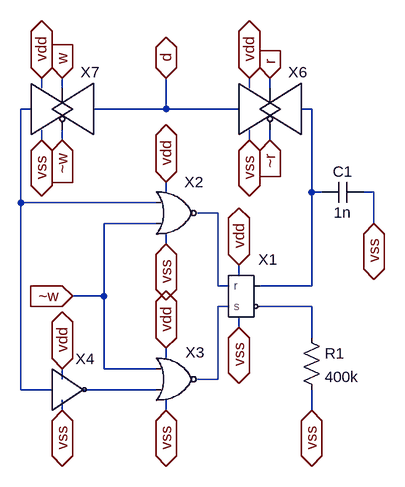
[diagram p0: schematic 1_bit_sram_cell.asc]
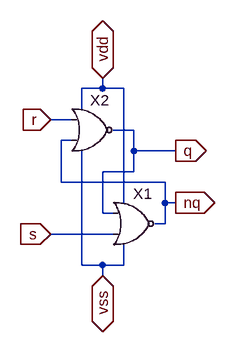
[diagram p1: sub-circuit sr_latch.asc]
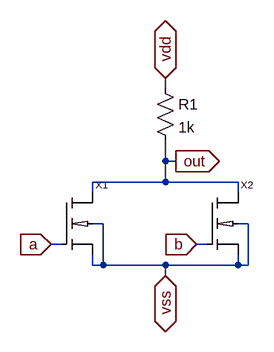
[diagram p2: sub-circuit nor.asc]
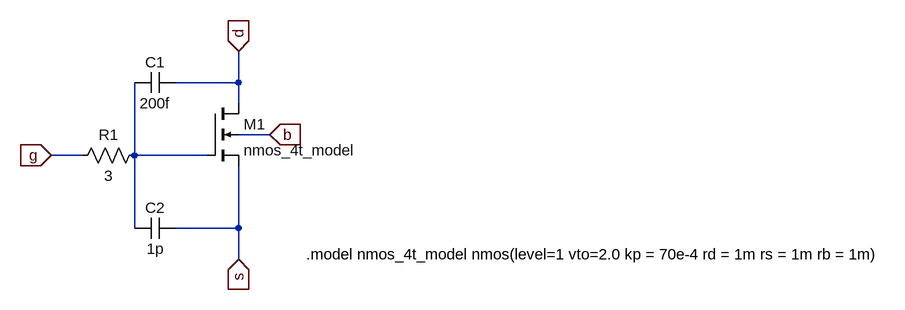
[diagram p3: sub-circuit nmos_4t.asc]
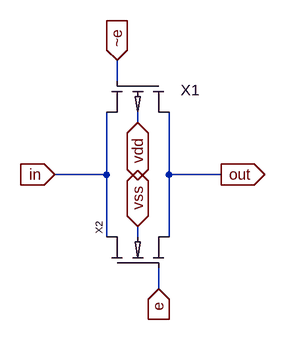
[diagram p4: sub-circuit transmission_gate.asc]
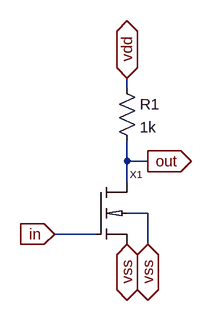
[diagram p5: sub-circuit not.asc]
1_bit_sram_cell.asc, the LTspice schematic file:
Version 4
SHEET 1 880 680
WIRE -128 -96 -128 -112
WIRE -96 -96 -96 -112
WIRE 192 -96 192 -112
WIRE 224 -96 224 -112
WIRE -144 -64 -160 -64
WIRE 64 -64 64 -112
WIRE 64 -64 -48 -64
WIRE 176 -64 64 -64
WIRE 288 -64 272 -64
WIRE -128 -16 -128 -32
WIRE -96 -16 -96 -32
WIRE 192 -16 192 -32
WIRE 224 -16 224 -32
WIRE 64 64 64 48
WIRE 288 64 288 -64
WIRE 304 64 288 64
WIRE 384 64 368 64
WIRE -160 80 -160 -64
WIRE 48 80 -160 80
WIRE 144 96 112 96
WIRE 48 112 -32 112
WIRE 384 112 384 64
WIRE 64 144 64 128
WIRE 176 192 176 176
WIRE 144 208 144 96
WIRE 160 208 144 208
WIRE 288 208 288 64
WIRE 288 208 208 208
WIRE -32 224 -32 112
WIRE -32 224 -80 224
WIRE 160 240 144 240
WIRE 288 240 208 240
WIRE 176 272 176 256
WIRE 288 288 288 240
WIRE 64 320 64 304
WIRE -32 336 -32 224
WIRE 48 336 -32 336
WIRE -96 352 -96 336
WIRE 144 352 144 240
WIRE 144 352 112 352
WIRE -160 368 -160 80
WIRE -112 368 -160 368
WIRE 48 368 -64 368
WIRE -96 400 -96 384
WIRE 64 400 64 384
WIRE 288 400 288 368
FLAG 64 48 vdd
IOPIN 64 48 BiDir
FLAG 64 144 vss
IOPIN 64 144 BiDir
FLAG 64 304 vdd
IOPIN 64 304 BiDir
FLAG 64 400 vss
IOPIN 64 400 BiDir
FLAG -96 -112 w
IOPIN -96 -112 In
FLAG 224 -112 r
IOPIN 224 -112 In
FLAG -80 224 ~w
IOPIN -80 224 In
FLAG 64 -112 d
IOPIN 64 -112 BiDir
FLAG -96 -16 ~w
IOPIN -96 -16 In
FLAG 224 -16 ~r
IOPIN 224 -16 In
FLAG -128 -112 vdd
IOPIN -128 -112 BiDir
FLAG -128 -16 vss
IOPIN -128 -16 BiDir
FLAG 192 -112 vdd
IOPIN 192 -112 BiDir
FLAG 192 -16 vss
IOPIN 192 -16 BiDir
FLAG 176 272 vss
IOPIN 176 272 BiDir
FLAG 176 176 vdd
IOPIN 176 176 BiDir
FLAG 288 400 vss
IOPIN 288 400 BiDir
FLAG -96 400 vss
IOPIN -96 400 BiDir
FLAG -96 336 vdd
IOPIN -96 336 BiDir
FLAG 384 112 vss
IOPIN 384 112 BiDir
SYMBOL sr_latch 192 224 R0
WINDOW 0 29 -41 Bottom 2
SYMATTR InstName X1
SYMBOL nor 80 32 R0
WINDOW 0 12 16 Left 2
SYMATTR InstName X2
SYMBOL nor 80 288 R0
WINDOW 0 14 23 Left 2
SYMATTR InstName X3
SYMBOL transmission_gate -96 -64 R0
WINDOW 0 43 -41 Bottom 2
SYMATTR InstName X7
SYMBOL transmission_gate 224 -64 R0
WINDOW 0 43 -41 Bottom 2
SYMATTR InstName X6
SYMBOL res 272 272 R0
SYMATTR InstName R1
SYMATTR Value 400k
SYMBOL not -112 368 R0
WINDOW 0 51 -32 Bottom 2
SYMATTR InstName X4
SYMBOL cap 368 48 R90
WINDOW 0 0 32 VBottom 2
WINDOW 3 32 32 VTop 2
SYMATTR InstName C1
SYMATTR Value 1n

sr_latch.asc, the sub-circuit schematic file:
Version 4
SHEET 1 880 680
WIRE 208 0 208 -16
WIRE 208 0 176 0
WIRE 240 0 208 0
WIRE 176 32 176 0
WIRE 160 48 128 48
WIRE 256 64 224 64
WIRE 160 80 144 80
WIRE 256 96 256 64
WIRE 320 96 256 96
WIRE 256 128 256 96
WIRE 256 128 208 128
WIRE 144 144 144 80
WIRE 304 144 144 144
WIRE 240 176 240 0
WIRE 304 176 304 144
WIRE 320 176 304 176
WIRE 208 192 208 128
WIRE 224 192 208 192
WIRE 304 208 304 176
WIRE 304 208 288 208
WIRE 224 224 128 224
WIRE 176 272 176 96
WIRE 208 272 176 272
WIRE 240 272 240 240
WIRE 240 272 208 272
WIRE 208 288 208 272
FLAG 128 224 s
IOPIN 128 224 In
FLAG 128 48 r
IOPIN 128 48 In
FLAG 320 96 q
IOPIN 320 96 Out
FLAG 320 176 nq
IOPIN 320 176 Out
FLAG 208 288 vss
IOPIN 208 288 BiDir
FLAG 208 -16 vdd
IOPIN 208 -16 BiDir
SYMBOL nor 256 144 R0
WINDOW 0 -1 18 Left 2
SYMATTR InstName X1
SYMBOL nor 192 0 R0
WINDOW 0 -3 18 Left 2
SYMATTR InstName X2

nor.asc, the sub-circuit schematic file:
Version 4
SHEET 1 880 680
WIRE 240 48 240 32
WIRE 240 160 240 128
WIRE 256 160 240 160
WIRE 240 192 240 160
WIRE 240 192 128 192
WIRE 352 192 240 192
WIRE 128 208 128 192
WIRE 352 208 352 192
WIRE 144 256 128 256
WIRE 368 256 352 256
WIRE 80 288 64 288
WIRE 304 288 288 288
WIRE 128 320 128 304
WIRE 144 320 144 256
WIRE 144 320 128 320
WIRE 240 320 144 320
WIRE 352 320 352 304
WIRE 352 320 240 320
WIRE 368 320 368 256
WIRE 368 320 352 320
WIRE 240 336 240 320
FLAG 240 32 vdd
IOPIN 240 32 BiDir
FLAG 240 336 vss
IOPIN 240 336 BiDir
FLAG 256 160 out
IOPIN 256 160 Out
FLAG 288 288 b
IOPIN 288 288 In
FLAG 64 288 a
IOPIN 64 288 In
SYMBOL res 224 32 R0
SYMATTR InstName R1
SYMATTR Value 1k
SYMBOL nmos_4t 80 208 R0
SYMATTR InstName X1
SYMBOL nmos_4t 304 208 R0
SYMATTR InstName X2

nmos_4t.asc, the sub-circuit schematic file:
Version 4
SHEET 1 880 680
WIRE -288 -224 -288 -272
WIRE -288 -224 -384 -224
WIRE -288 -192 -288 -224
WIRE -240 -144 -288 -144
WIRE -528 -112 -576 -112
WIRE -448 -112 -448 -224
WIRE -336 -112 -448 -112
WIRE -448 0 -448 -112
WIRE -288 0 -288 -96
WIRE -288 0 -384 0
WIRE -288 48 -288 0
FLAG -576 -112 g
IOPIN -576 -112 In
FLAG -288 -272 d
IOPIN -288 -272 In
FLAG -288 48 s
IOPIN -288 48 In
FLAG -240 -144 b
IOPIN -240 -144 In
SYMBOL nmos4 -336 -192 R0
SYMATTR InstName M1
SYMATTR Value nmos_4t_model
SYMBOL cap -384 -240 R90
WINDOW 0 0 32 VBottom 2
WINDOW 3 32 32 VTop 2
SYMATTR InstName C1
SYMATTR Value 200f
SYMBOL cap -384 -16 R90
WINDOW 0 0 32 VBottom 2
WINDOW 3 32 32 VTop 2
SYMATTR InstName C2
SYMATTR Value 1p
SYMBOL res -432 -128 R90
WINDOW 0 0 56 VBottom 2
WINDOW 3 32 56 VTop 2
SYMATTR InstName R1
SYMATTR Value 3
TEXT -184 40 Left 2 !.model nmos_4t_model nmos(level=1 vto=2.0 kp = 70e-4 rd = 1m rs = 1m rb = 1m)

transmission_gate.asc, the sub-circuit schematic file:
Version 4
SHEET 1 880 680
WIRE 208 16 208 -16
WIRE 240 80 240 64
WIRE 192 160 192 64
WIRE 192 160 112 160
WIRE 288 160 288 64
WIRE 368 160 288 160
WIRE 192 256 192 160
WIRE 240 256 240 240
WIRE 288 256 288 160
WIRE 272 336 272 304
FLAG 112 160 in
IOPIN 112 160 In
FLAG 272 336 e
IOPIN 272 336 In
FLAG 368 160 out
IOPIN 368 160 Out
FLAG 208 -16 ~e
IOPIN 208 -16 In
FLAG 240 80 vdd
IOPIN 240 80 BiDir
FLAG 240 240 vss
IOPIN 240 240 BiDir
SYMBOL pmos_4t 288 16 R90
WINDOW 0 14 -47 VRight 2
SYMATTR InstName X1
SYMBOL nmos_4t 192 304 R270
SYMATTR InstName X2

not.asc, the sub-circuit schematic file:
Version 4
SHEET 1 880 680
WIRE 176 -96 176 -112
WIRE 176 16 176 -16
WIRE 208 16 176 16
WIRE 176 48 176 16
WIRE 208 96 176 96
WIRE 128 128 64 128
WIRE 208 144 208 96
FLAG 64 128 in
IOPIN 64 128 In
FLAG 176 144 vss
IOPIN 176 144 BiDir
FLAG 176 -112 vdd
IOPIN 176 -112 BiDir
FLAG 208 16 out
IOPIN 208 16 Out
FLAG 208 144 vss
IOPIN 208 144 BiDir
SYMBOL res 160 -112 R0
SYMATTR InstName R1
SYMATTR Value 1k
SYMBOL nmos_4t 128 48 R0
SYMATTR InstName X1

The netlist it stands for:
* 1_bit_sram_cell.asc
XX1 N003 N004 N005 N002 vdd vss sr_latch
XX2 N001 ~w vdd vss N003 nor
XX3 ~w N006 vdd vss N004 nor
XX7 w N001 ~w d vdd vss transmission_gate
XX6 r d ~r N002 vdd vss transmission_gate
R1 N005 vss 400k
XX4 N001 N006 vss vdd not
C1 vss N002 1n

* block symbol definitions
.subckt sr_latch r s nq q vdd vss
XX1 q s vdd vss nq nor
XX2 r nq vdd vss q nor
.ends sr_latch

.subckt nor a b vdd vss out
R1 vdd out 1k
XX1 out a vss vss nmos_4t
XX2 out b vss vss nmos_4t
.ends nor

.subckt nmos_4t D G S B
M1 d N001 s b nmos_4t_model
C1 d N001 200f
C2 s N001 1p
R1 N001 g 3
.model nmos_4t_model nmos(level=1 vto=2.0 kp = 70e-4 rd = 1m rs = 1m rb = 1m)
.ends nmos_4t

.subckt transmission_gate e in ~e out vdd vss
XX1 out ~e in vdd pmos_4t  ; pins D G S B
XX2 in e out vss nmos_4t
.ends transmission_gate

.subckt not in out vss vdd
R1 vdd out 1k
XX1 out in vss vss nmos_4t
.ends not

.model NMOS NMOS
.model PMOS PMOS
.lib standard.mos
.backanno
.end